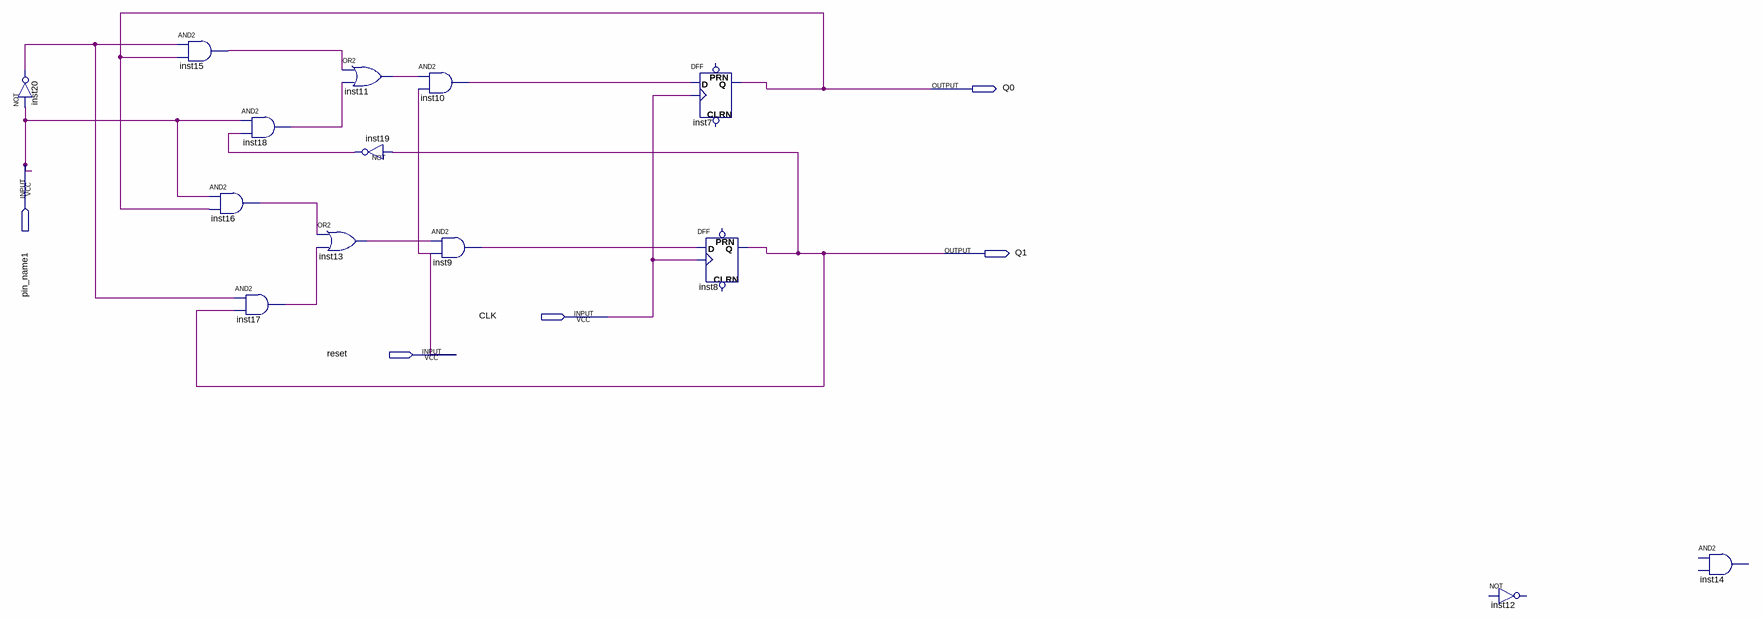
[diagram p0: schematic sheet]
// Quartus schematic ex1.bdf as structural Verilog: 14 symbols, 5 pins
module ex1 (
  input  pin_name1,
  input  CLK,
  input  reset,
  output Q0,
  output Q1
);

  wire inst9_out, inst10_out, inst11_out, inst13_out, inst15_out, inst16_out, inst17_out, inst18_out,
       inst19_out, inst20_out;

  not inst20 (inst20_out, pin_name1);
  and inst15 (inst15_out, inst20_out, Q0);
  and inst16 (inst16_out, pin_name1, Q0);
  and inst17 (inst17_out, inst20_out, Q1);
  and inst18 (inst18_out, pin_name1, inst19_out);
  or inst13 (inst13_out, inst16_out, inst17_out);
  or inst11 (inst11_out, inst15_out, inst18_out);
  not inst19 (inst19_out, Q1);
  and inst10 (inst10_out, inst11_out, reset);
  and inst9 (inst9_out, inst13_out, reset);
  DFF inst7 (.CLK(CLK), .D(inst10_out), .Q(Q0));  // open: CLRN, PRN
  DFF inst8 (.CLK(CLK), .D(inst9_out), .Q(Q1));  // open: CLRN, PRN
  // NOT inst12 is placed but not wired
  // AND2 inst14 is placed but not wired
endmodule
